# Altium schematic sheet LCDTFT_FPC40P_LVDS_HC070IY30025.SchDoc
size A3
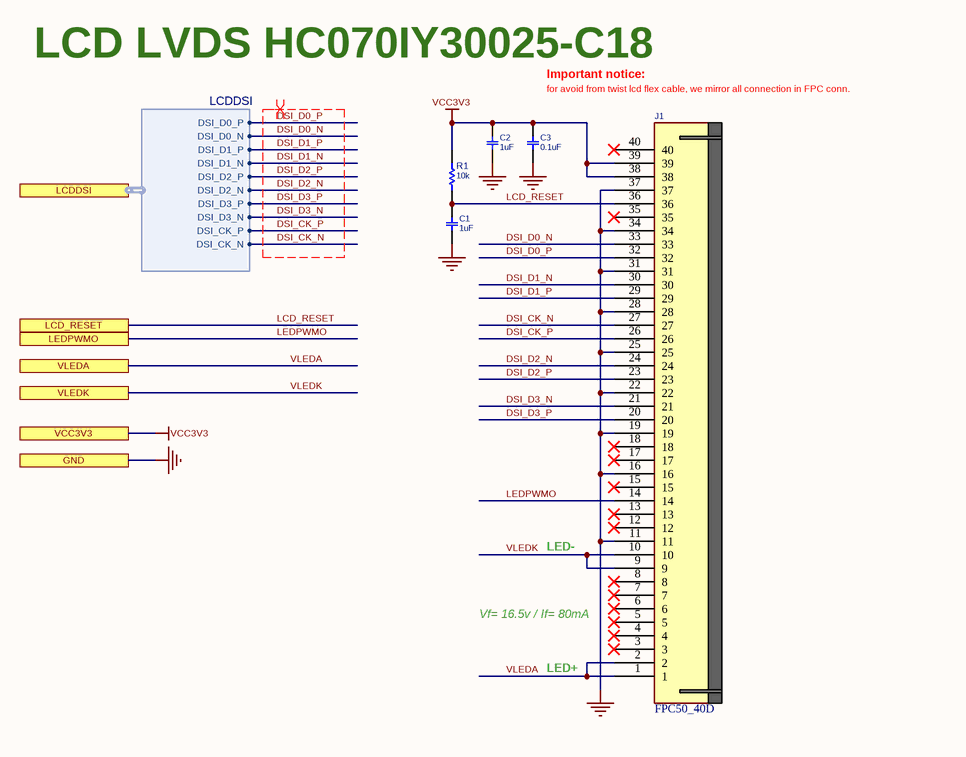
[diagram p0: LCDTFT_FPC40P_LVDS_HC070IY30025.SchDoc]

## Parts
C1  1uF  [C0402]
C2  1uF  [C0402]
C3  0.1uF  [C0402]
J1  FPC50_40D  [FPC50_40D_FFC2B29]
R1  10k  [R0402]

## Ports
GND, LCD_RESET, LCDDSI (harness LCDDSI), LEDPWMO, VCC3V3, VLEDA, VLEDK

## Harnesses
LCDDSI: DSI_D0_P, DSI_D0_N, DSI_D1_P, DSI_D1_N, DSI_D2_P, DSI_D2_N, DSI_D3_P, DSI_D3_N, DSI_CK_P, DSI_CK_N

## Nets
GND: C1.2 C2.2 C3.2 J1.11 J1.16 J1.19 J1.22 J1.25 J1.28 J1.31 J1.34 J1.37 ; port GND
VCC3V3: C2.1 C3.1 J1.38 J1.39 R1.1 ; port VCC3V3
DSI_CK_N: J1.27 ; port LCDDSI.DSI_CK_N
DSI_CK_P: J1.26 ; port LCDDSI.DSI_CK_P
DSI_D0_N: J1.33 ; port LCDDSI.DSI_D0_N
DSI_D0_P: J1.32 ; port LCDDSI.DSI_D0_P
DSI_D1_N: J1.30 ; port LCDDSI.DSI_D1_N
DSI_D1_P: J1.29 ; port LCDDSI.DSI_D1_P
DSI_D2_N: J1.24 ; port LCDDSI.DSI_D2_N
DSI_D2_P: J1.23 ; port LCDDSI.DSI_D2_P
DSI_D3_N: J1.21 ; port LCDDSI.DSI_D3_N
DSI_D3_P: J1.20 ; port LCDDSI.DSI_D3_P
LCD_RESET: C1.1 J1.36 R1.2 ; port LCD_RESET
LEDPWMO: J1.14 ; port LEDPWMO
VLEDA: J1.1 J1.2 ; port VLEDA
VLEDK: J1.9 J1.10 ; port VLEDK

Not connected (* = marked no-connect by the designer): J1 3* 4* 5* 6* 7* 8* 12* 13* 15* 17* 18* 35* 40*

## Layout directives
differential pair: DSI_CK_N, DSI_CK_P, DSI_D0_N, DSI_D0_P, DSI_D1_N, DSI_D1_P, DSI_D2_N, DSI_D2_P, DSI_D3_N, DSI_D3_P

## Notes on the sheet
- LCD LVDS HC070IY30025-C18
- Important notice:
- for avoid from twist lcd flex cable, we mirror all connection in FPC conn.
- LED-
- Vf= 16.5v / If= 80mA
- LED+

## Library data of the parts
C1 C2 = CAP_SMD_MLCC: CAP, MLCC; PARAM: X5R, 10%; MANF_P#: CL05A105KO5NNND; MANF: Samsung; PARAM2: 16v; PRICE: 50,000:	$0.006; ASSEMBLY: ASSEMBLY; VALUE: 1uF; PACKAGE: 0402
C3 = CAP_SMD_MLCC: CAP, MLCC; PARAM: X7R, 10%, -55~125oC; MANF_P#: GRM155R71H104KE14D; MANF: Murata; PARAM2: 50v; PRICE: 100: 0.018$; ASSEMBLY: ASSEMBLY; VALUE: 0.1uF; PACKAGE: 0402
J1 = FPC50_40D_FFC2B29: CONN, FPC, 0.50mm pitch, RightAngle, Dual side Contact; MANF: GCT; MANF_P#: FFC2B29-40-G; VALUE: FPC50_40D
R1 = RES_SMD: RESISTOR, SMD; PARAM: 0.063W; DESC: DESCRIPTION; DIST#: MOUSER; PARAM2: 1%; MANF_P#: -; MANF: -; ASSEMBLY: ASSEMBLY; PRICE: 100= 0.3$; VALUE: 10k; PACKAGE: 0402